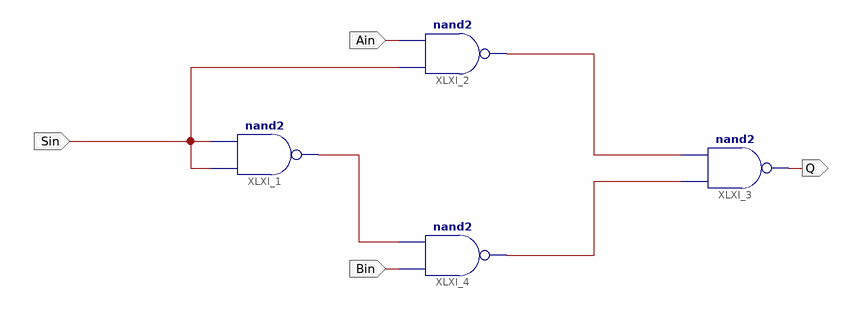
[diagram p0: schematic sheet 1]
// Xilinx ISE schematic lab6_experiment5_2_1_MUX.sch (spartan3e) as structural Verilog: 4 symbols, 4 ports
module lab6_experiment5_2_1_MUX (
  input  Sin,
  input  Ain,
  input  Bin,
  output Q
);

  wire XLXN_5, XLXN_8, XLXN_9;

  nand XLXI_1 (XLXN_5, Sin, Sin);
  nand XLXI_2 (XLXN_9, Sin, Ain);
  nand XLXI_3 (Q, XLXN_8, XLXN_9);
  nand XLXI_4 (XLXN_8, Bin, XLXN_5);
endmodule
